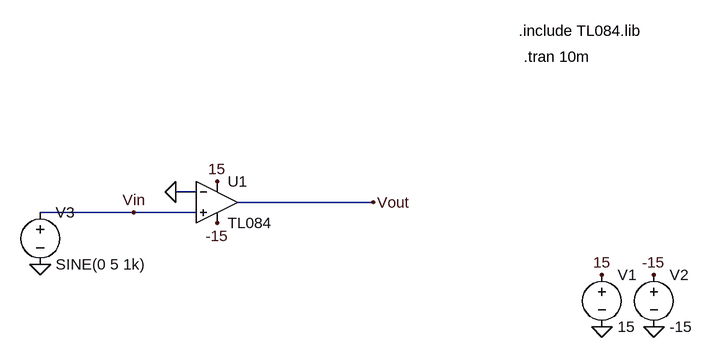
[diagram p0: schematic Square.asc]
Square.asc, the LTspice schematic file:
Version 4
SHEET 1 880 680
WIRE 80 272 48 272
WIRE 352 288 144 288
WIRE -16 304 -160 304
WIRE 80 304 -16 304
FLAG 48 272 0
FLAG 112 256 15
FLAG 704 400 15
FLAG 112 320 -15
FLAG 784 400 -15
FLAG 704 480 0
FLAG 784 480 0
FLAG 352 288 Vout
FLAG -16 304 Vin
FLAG -160 384 0
SYMBOL Opamps\\opamp2 112 224 R0
SYMATTR InstName U1
SYMATTR Value TL084
SYMBOL voltage 704 384 R0
WINDOW 123 0 0 Left 0
WINDOW 39 0 0 Left 0
SYMATTR InstName V1
SYMATTR Value 15
SYMBOL voltage 784 384 R0
WINDOW 123 0 0 Left 0
WINDOW 39 0 0 Left 0
SYMATTR InstName V2
SYMATTR Value -15
SYMBOL voltage -160 288 R0
WINDOW 123 0 0 Left 0
WINDOW 39 0 0 Left 0
SYMATTR InstName V3
SYMATTR Value SINE(0 5 1k)
TEXT 576 24 Left 2 !.include TL084.lib
TEXT 584 64 Left 2 !.tran 10m

The netlist it stands for:
* Square.asc
XU1 Vin 0 15 -15 Vout TL084  ; pins In+ In- V+ V- OUT
V1 15 0 15
V2 -15 0 -15
V3 Vin 0 SINE(0 5 1k)
.include TL084.lib
.tran 10m
.backanno
.end